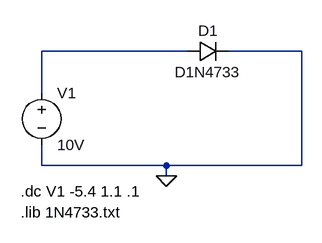
[diagram p0: schematic Diode_1N4733.asc]
Diode_1N4733.asc, the LTspice schematic file:
Version 4
SHEET 1 880 680
WIRE 256 112 32 112
WIRE 432 112 320 112
WIRE 32 176 32 112
WIRE 32 288 32 256
WIRE 224 288 32 288
WIRE 432 288 432 112
WIRE 432 288 224 288
WIRE 224 304 224 288
FLAG 224 304 0
SYMBOL diode 256 128 R270
WINDOW 0 32 32 VTop 2
WINDOW 3 0 32 VBottom 2
SYMATTR InstName D1
SYMATTR Value D1N4733
SYMBOL voltage 32 160 R0
SYMATTR InstName V1
SYMATTR Value 10V
TEXT 0 328 Left 2 !.dc V1 -5.4 1.1 .1
TEXT 0 360 Left 2 !.lib 1N4733.txt

The netlist it stands for:
* Diode_1N4733.asc
D1 N001 0 D1N4733
V1 N001 0 10V
.model D D
.lib standard.dio
.dc V1 -5.4 1.1 .1
.lib 1N4733.txt
.backanno
.end